# EAGLE schematic dhtxx+heater (EAGLE 6.5.0)
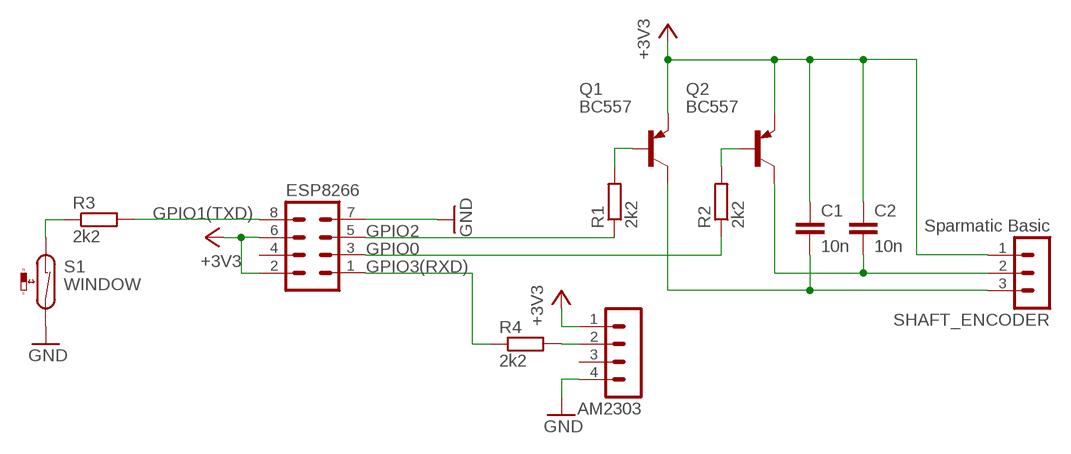
[diagram p0: schematic, sheet 1]

## Parts
AM2303  MA04-1  [MA04-1]
C1  10n  C-EU075-032X103  [C075-032X103]
C2  10n  C-EU075-032X103  [C075-032X103]
ESP8266  MA04-2  [MA04-2]
Q1  BC557  [TO92-EBC]
Q2  BC557  [TO92-EBC]
R1  2k2  R-EU_0204/7  [0204/7]
R2  2k2  R-EU_0204/7  [0204/7]
R3  2k2  R-EU_0204/7  [0204/7]
R4  2k2  R-EU_0204/7  [0204/7]
S1  WINDOW  REED-SWITCH-MK6-8-H  [MK6-8-A]
SHAFT_ENCODER  Sparmatic Basic  MA03-1  [MA03-1]

## Nets
+3V3: AM2303.1 C1.1 C2.1 ESP8266.2 ESP8266.6 Q1.E Q2.E SHAFT_ENCODER.1
GND: AM2303.4 ESP8266.7 S1.2
GPIO0: ESP8266.3 R2.1
GPIO1(TXD): ESP8266.8 R3.2
GPIO2: ESP8266.5 R1.1
GPIO3(RXD): ESP8266.1 R4.1
N$1: Q1.B R1.2
N$2: Q2.B R2.2
N$3: R3.1 S1.1
N$4: C2.2 Q2.C SHAFT_ENCODER.2
N$5: C1.2 Q1.C SHAFT_ENCODER.3
N$6: AM2303.2 R4.2
Unconnected: AM2303.3 ESP8266.4

## Library data of the parts
AM2303 = con-lstb:MA04-1: PIN HEADER; OC_FARNELL: unknown; OC_NEWARK: unknown
C1 C2 = rcl:C-EU: CAPACITOR, European symbol
ESP8266 = con-lstb:MA04-2: PIN HEADER; OC_FARNELL: unknown; OC_NEWARK: unknown
Q1 Q2 = transistor-pnp:BC557*: PNP Transistror
R1-R4 = rcl:R-EU_: RESISTOR, European symbol
S1 = switch-reed:REED-SWITCH-: Reed Sensor; MF: MEDER; MPN: MK6-8-H; OC_FARNELL: 1079482
SHAFT_ENCODER = con-lstb:MA03-1: PIN HEADER; OC_FARNELL: unknown; OC_NEWARK: unknown